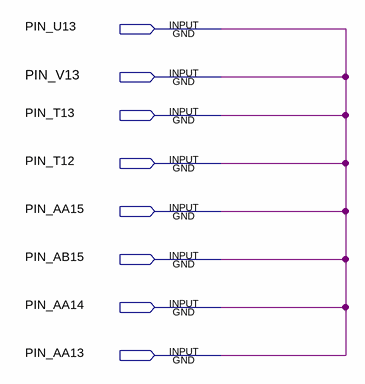
[diagram p0: schematic sheet]
// Quartus schematic Additional.bdf as structural Verilog: 0 symbols, 8 pins
module Additional (
  input  PIN_U13,
  input  PIN_V13,
  input  PIN_T13,
  input  PIN_T12,
  input  PIN_AA15,
  input  PIN_AB15,
  input  PIN_AA14,
  input  PIN_AA13
);


  assign PIN_AA14 = PIN_AA13;
  assign PIN_AA15 = PIN_AA13;
  assign PIN_AB15 = PIN_AA13;
  assign PIN_T12 = PIN_AA13;
  assign PIN_T13 = PIN_AA13;
  assign PIN_U13 = PIN_AA13;
  assign PIN_V13 = PIN_AA13;
endmodule
